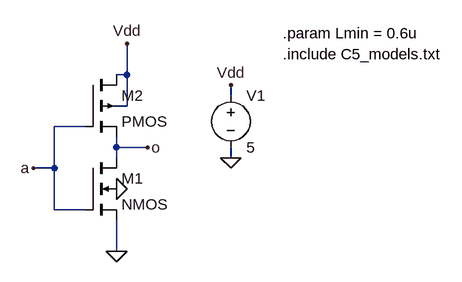
[diagram p0: schematic INV.asc]
INV.asc, the LTspice schematic file:
Version 4
SHEET 1 936 852
WIRE -240 288 -240 240
WIRE -240 288 -256 288
WIRE -80 320 -80 304
WIRE -240 336 -240 288
WIRE -240 336 -256 336
WIRE -304 368 -352 368
WIRE -256 400 -256 384
WIRE -208 400 -256 400
WIRE -256 416 -256 400
WIRE -80 416 -80 400
WIRE -352 432 -352 368
WIRE -352 432 -384 432
WIRE -352 496 -352 432
WIRE -304 496 -352 496
WIRE -256 560 -256 512
FLAG -256 464 0
FLAG -256 560 0
FLAG -240 240 Vdd
FLAG -384 432 a
FLAG -208 400 o
FLAG -80 416 0
FLAG -80 304 Vdd
SYMBOL nmos4 -304 416 R0
SYMATTR InstName M1
SYMATTR Value2 l='Lmin' w='Wnmos1' ad='Lmin*Wnmos1' as='Lmin*Wnmos1' pd='2*(Lmin+Wnmos1)' ps='2*(Lmin+Wnmos1)' m=1
SYMBOL pmos4 -304 288 R0
SYMATTR InstName M2
SYMATTR Value2 l='Lmin' w='Wpmos1' ad='Lmin*Wpmos1' as='Lmin*Wpmos1' pd='2*(Lmin+Wpmos1)' ps='2*(Lmin+Wpmos1)' m=1
SYMBOL voltage -80 304 R0
SYMATTR InstName V1
SYMATTR Value 5
TEXT 0 256 Left 2 !.include C5_models.txt
TEXT 0 224 Left 2 !.param Lmin = 0.6u

The netlist it stands for:
* INV.asc
M1 o a 0 0 NMOS l='Lmin' w='Wnmos1' ad='Lmin*Wnmos1' as='Lmin*Wnmos1' pd='2*(Lmin+Wnmos1)' ps='2*(Lmin+Wnmos1)' m=1
M2 Vdd a o Vdd PMOS l='Lmin' w='Wpmos1' ad='Lmin*Wpmos1' as='Lmin*Wpmos1' pd='2*(Lmin+Wpmos1)' ps='2*(Lmin+Wpmos1)' m=1
V1 Vdd 0 5
.model NMOS NMOS
.model PMOS PMOS
.lib standard.mos
.include C5_models.txt
.param Lmin = 0.6u
.backanno
.end